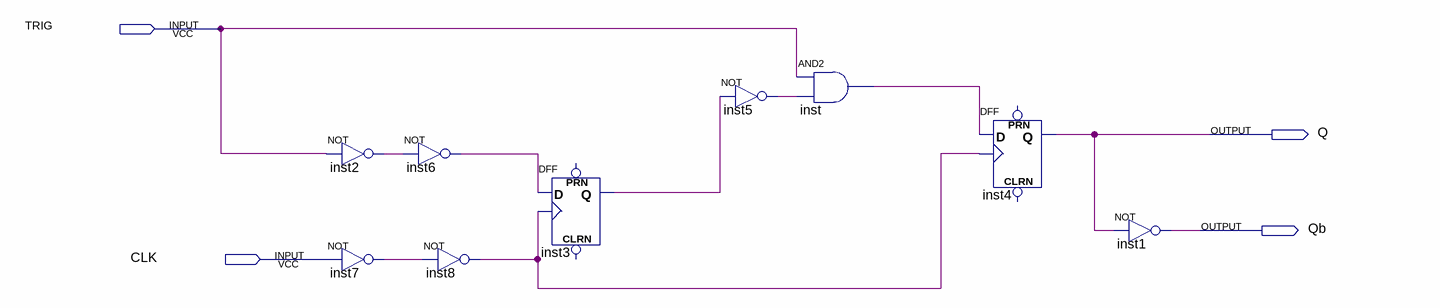
[diagram p0: schematic sheet]
// Quartus schematic MONOESTAVEL.bdf as structural Verilog: 9 symbols, 4 pins
module MONOESTAVEL (
  input  TRIG,
  input  CLK,
  output Q,
  output Qb
);

  wire inst2_out, inst3_q, inst5_out, inst6_out, inst7_out, inst8_out, inst_out;

  not inst2 (inst2_out, TRIG);
  not inst7 (inst7_out, CLK);
  not inst6 (inst6_out, inst2_out);
  not inst8 (inst8_out, inst7_out);
  DFF inst3 (.CLK(inst8_out), .D(inst6_out), .Q(inst3_q));  // open: CLRN, PRN
  not inst5 (inst5_out, inst3_q);
  and inst (inst_out, TRIG, inst5_out);
  DFF inst4 (.CLK(inst8_out), .D(inst_out), .Q(Q));  // open: CLRN, PRN
  not inst1 (Qb, Q);
endmodule
